# Altium schematic sheet FIPEX.SchDoc
size A4
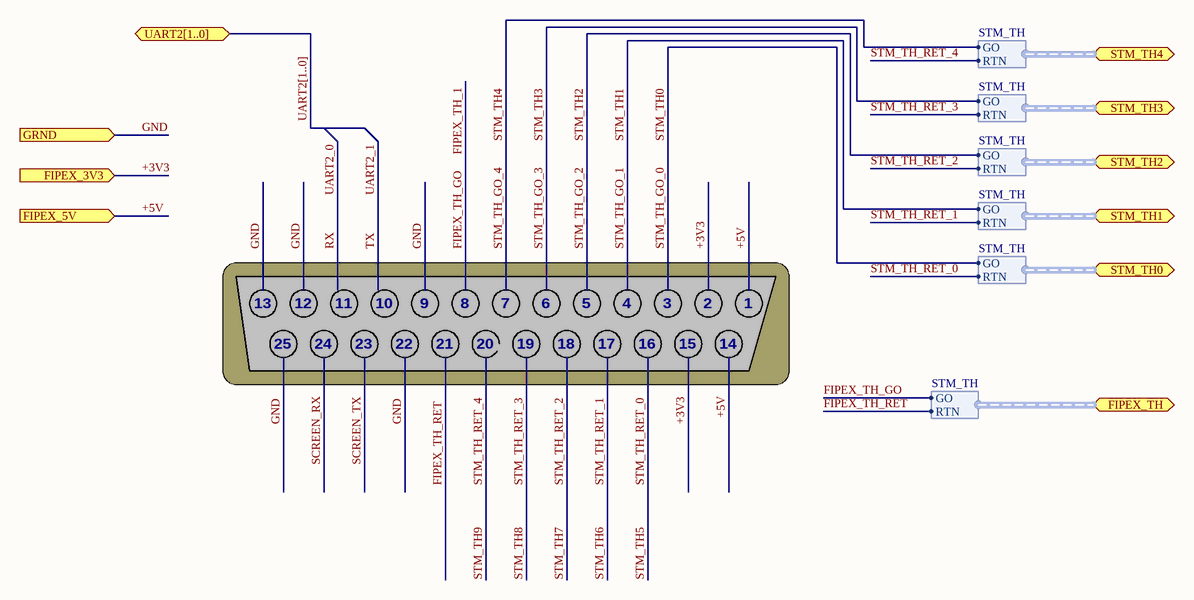
[diagram p0: FIPEX.SchDoc]

## Ports
FIPEX_3V3 (in), FIPEX_5V (in), FIPEX_TH (harness STM_TH), GRND (in), STM_TH0 (harness STM_TH), STM_TH1 (harness STM_TH), STM_TH2 (harness STM_TH), STM_TH3 (harness STM_TH), STM_TH4 (harness STM_TH), UART2[1..0] (bidir)

## Harnesses
STM_TH: GO, RTN

## Nets
+3V3: port FIPEX_3V3
+5V: port FIPEX_5V
FIPEX_TH_1: port FIPEX_TH.GO  [also labelled FIPEX_TH_GO]
FIPEX_TH_RET: port FIPEX_TH.RTN
GND: port GRND
STM_TH0: port STM_TH0.GO  [also labelled STM_TH_GO_0]
STM_TH1: port STM_TH1.GO  [also labelled STM_TH_GO_1]
STM_TH2: port STM_TH2.GO  [also labelled STM_TH_GO_2]
STM_TH3: port STM_TH3.GO  [also labelled STM_TH_GO_3]
STM_TH4: port STM_TH4.GO  [also labelled STM_TH_GO_4]
STM_TH5: port STM_TH0.RTN  [also labelled STM_TH_RET_0]
STM_TH6: port STM_TH1.RTN  [also labelled STM_TH_RET_1]
STM_TH7: port STM_TH2.RTN  [also labelled STM_TH_RET_2]
STM_TH8: port STM_TH3.RTN  [also labelled STM_TH_RET_3]
STM_TH9: port STM_TH4.RTN  [also labelled STM_TH_RET_4]

## Buses and harness runs
bus UART2[1..0] = port UART2[1..0]

## Notes on the sheet
- 13
- 12
- 11
- 10
- 9
- 8
- 7
- 6
- 5
- 4
- 3
- 2
- 1
- 25
- 24
- 23
- 22
- 21
- 20
- 19
- 18
- 17
- 16
- 15
- 14